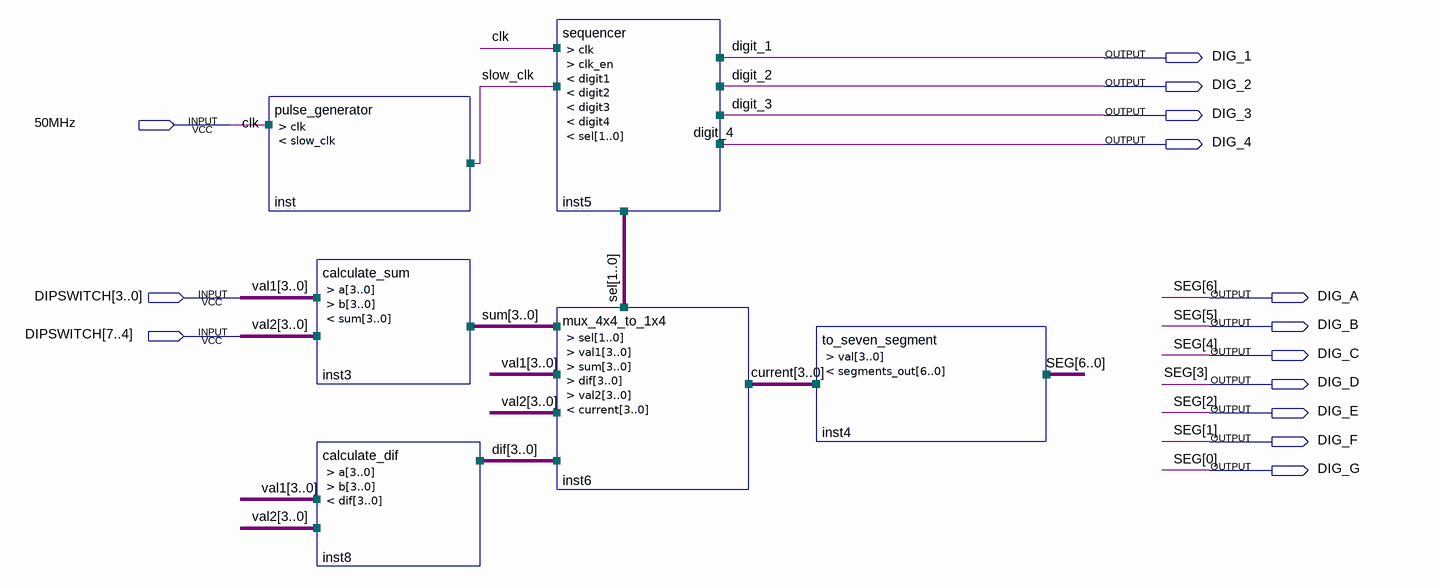
[diagram p0: schematic sheet]
// Quartus schematic seven_segment_exercise.bdf as structural Verilog: 6 symbols, 14 pins
module seven_segment_exercise (
  input  \50MHz ,
  input  [7:0] DIPSWITCH,
  output DIG_1,
  output DIG_2,
  output DIG_3,
  output DIG_4,
  output DIG_A,
  output DIG_B,
  output DIG_C,
  output DIG_D,
  output DIG_E,
  output DIG_F,
  output DIG_G
);

  wire slow_clk;
  wire [1:0] sel;
  wire [3:0] current, dif, sum;

  pulse_generator inst (.clk(\50MHz ), .slow_clk(slow_clk));
  calculate_sum inst3 (.a(DIPSWITCH[3:0]), .b(DIPSWITCH[7:4]), .sum(sum));
  calculate_dif inst8 (.a(DIPSWITCH[3:0]), .b(DIPSWITCH[7:4]), .dif(dif));
  sequencer inst5 (
    .clk(\50MHz ), .clk_en(slow_clk), .digit1(DIG_1), .digit2(DIG_2), .digit3(DIG_3), .digit4(DIG_4),
    .sel(sel));
  mux_4x4_to_1x4 inst6 (
    .sel(sel), .val1(DIPSWITCH[3:0]), .sum(sum), .dif(dif), .val2(DIPSWITCH[7:4]), .current(current));
  to_seven_segment inst4 (.val(current), .segments_out({DIG_A, DIG_B, DIG_C, DIG_D, DIG_E, DIG_F, DIG_G}));

  // Other names for the same wires on the sheet: clk = \50MHz ; digit_1 = DIG_1; digit_2 = DIG_2; digit_3 = DIG_3;
  //   digit_4 = DIG_4; SEG[6:0] = {DIG_A, DIG_B, DIG_C, DIG_D, DIG_E, DIG_F, DIG_G}; val1[3:0] = DIPSWITCH[3:0];
  //   val2[3:0] = DIPSWITCH[7:4]
endmodule
